# EAGLE design db_02 (EAGLE 7.7.0)
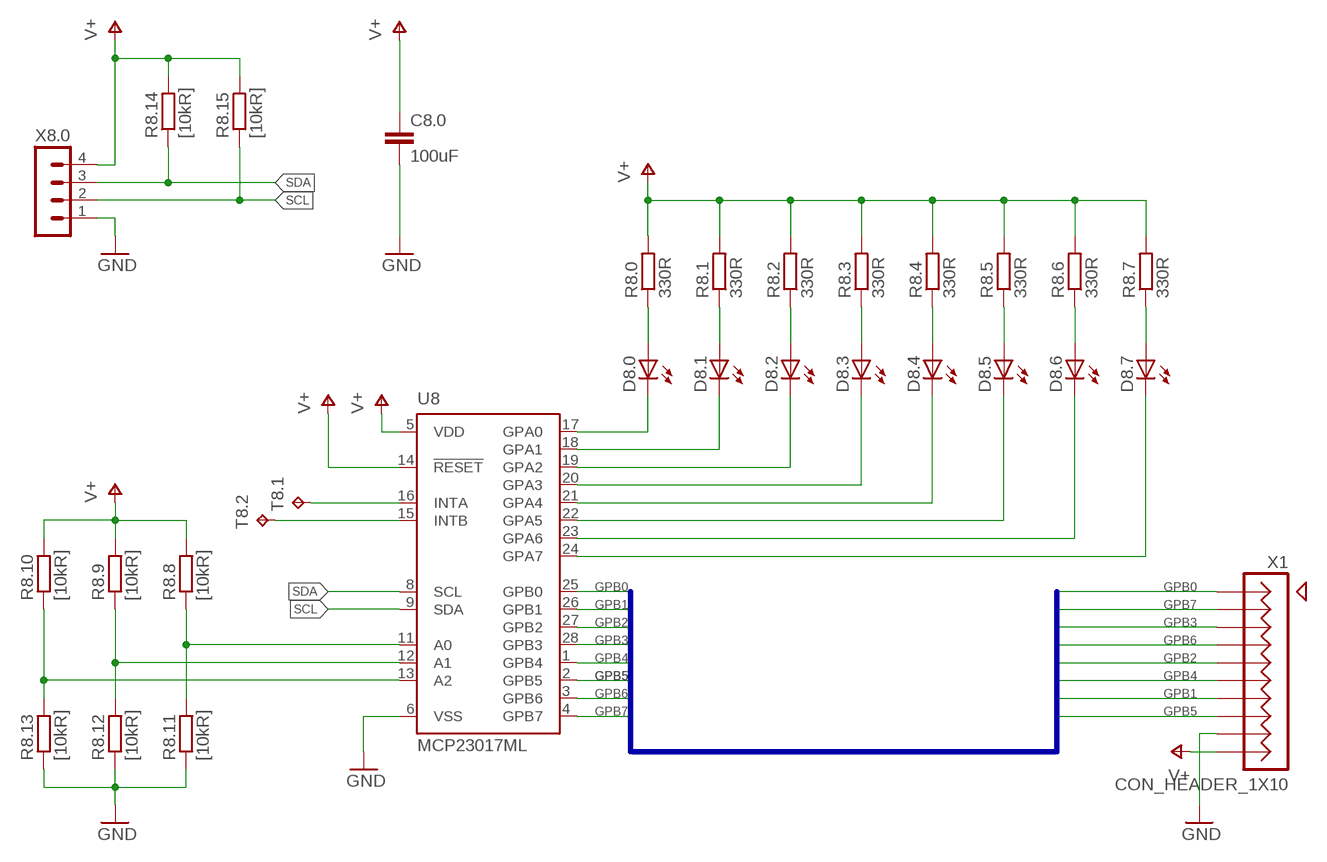
[diagram p0: schematic, sheet 1]

## Parts
C8.0  100uF  C-EUC0603  [C0603]
D8.0  LEDCHIPLED_1206  [CHIPLED_1206]
D8.1  LEDCHIPLED_1206  [CHIPLED_1206]
D8.2  LEDCHIPLED_1206  [CHIPLED_1206]
D8.3  LEDCHIPLED_1206  [CHIPLED_1206]
D8.4  LEDCHIPLED_1206  [CHIPLED_1206]
D8.5  LEDCHIPLED_1206  [CHIPLED_1206]
D8.6  LEDCHIPLED_1206  [CHIPLED_1206]
D8.7  LEDCHIPLED_1206  [CHIPLED_1206]
R8.0  330R  R-EU_R0603  [R0603]
R8.1  330R  R-EU_R0603  [R0603]
R8.2  330R  R-EU_R0603  [R0603]
R8.3  330R  R-EU_R0603  [R0603]
R8.4  330R  R-EU_R0603  [R0603]
R8.5  330R  R-EU_R0603  [R0603]
R8.6  330R  R-EU_R0603  [R0603]
R8.7  330R  R-EU_R0603  [R0603]
R8.8  [10kR]  R-EU_R0402  [R0402]
R8.9  [10kR]  R-EU_R0402  [R0402]
R8.10  [10kR]  R-EU_R0402  [R0402]
R8.11  [10kR]  R-EU_R0402  [R0402]
R8.12  [10kR]  R-EU_R0402  [R0402]
R8.13  [10kR]  R-EU_R0402  [R0402]
R8.14  [10kR]  R-EU_R0402  [R0402]
R8.15  [10kR]  R-EU_R0402  [R0402]
T8.1  TPTP09SQ  [TP09SQ]
T8.2  TPTP09SQ  [TP09SQ]
U8  MCP23017ML  [QFN28-ML_6X6MM]
X1  CON_HEADER_1X10  [M1X10_SMD]
X8.0  MA04-1  [MA04-1]

## Nets
GND: C8.0.2 R8.11.1 R8.12.1 R8.13.1 U8.6(VSS) X1.P$9 X8.0.1
GPB0: U8.25(GPB0) X1.P$1
GPB1: U8.26(GPB1) X1.P$7
GPB2: U8.27(GPB2) X1.P$5
GPB3: U8.28(GPB3) X1.P$3
GPB4: U8.1(GPB4) X1.P$6
GPB5: U8.2(GPB5) X1.P$8
GPB6: U8.3(GPB6) X1.P$4
GPB7: U8.4(GPB7) X1.P$2
N$1: D8.0.C U8.17(GPA0)
N$2: D8.1.C U8.18(GPA1)
N$3: D8.2.C U8.19(GPA2)
N$4: D8.3.C U8.20(GPA3)
N$5: D8.4.C U8.21(GPA4)
N$6: D8.5.C U8.22(GPA5)
N$7: D8.6.C U8.23(GPA6)
N$8: D8.7.C U8.24(GPA7)
N$9: D8.0.A R8.0.1
N$10: D8.1.A R8.1.1
N$11: D8.2.A R8.2.1
N$12: D8.3.A R8.3.1
N$13: D8.4.A R8.4.1
N$14: D8.5.A R8.5.1
N$15: D8.6.A R8.6.1
N$16: D8.7.A R8.7.1
N$17: R8.8.1 R8.11.2 U8.11(A0)
N$18: R8.9.1 R8.12.2 U8.12(A1)
N$19: R8.10.1 R8.13.2 U8.13(A2)
N$23: T8.1.TP U8.16(INTA)
N$24: T8.2.TP U8.15(INTB)
SCL: R8.15.1 U8.9(SDA) X8.0.2
SDA: R8.14.1 U8.8(SCL) X8.0.3
V+: C8.0.1 R8.0.2 R8.1.2 R8.2.2 R8.3.2 R8.4.2 R8.5.2 R8.6.2 R8.7.2 R8.8.2 R8.9.2 R8.10.2 R8.14.2 R8.15.2 U8.5(VDD) U8.14(!RESET) X1.P$10 X8.0.4

## Buses
GPB[0..7]

## Library data of the parts
C8.0 = rcl:C-EU: CAPACITOR, European symbol
D8.0 D8.1-D8.7 = led:LED: LED OSRAM: - CHIPLED LG R971, LG N971, LY N971, LG Q971, LY Q971, LO R971, LY R971 LH N974, LH R974 LS Q976, LO Q976, LY Q976 LO Q996 - Hyper CHIPLED LW Q18S LB Q993, LB Q99A, LB R99A - SideLED LS A670, LO A670, LY A670, LG A670, LP A670 LB A673, LV A673, LT A673, LW A673 LH A674 LY A675 LS A676, LA A676, LO A676, LY A676, LW A676 LS A679, LY A679, LG A679 - Hyper Micro SIDELED® LS Y876, LA Y876, LO Y876, LY Y876 LT Y87S - SmartLED LW L88C, LW L88S LB L89C, LB L89S, LG L890 LS L89K, LO L89K, LY L89K LS L896, LA L896, LO L896, LY L896 - TOPLED LS T670, LO T670, LY T670, LG T670, LP T670 LSG T670, LSP T670, LSY T670, LOP T670, LYG T670 LG T671, LOG T671, LSG T671 LB T673, LV T673, LT T673, LW T673 LH T674 LS T676, LA T676, LO T676, LY T676, LB T676, LH T676, LSB T676, LW T676 LB T67C, LV T67C, LT T67C, LS T67K, LO T67K, LY T67K, LW E67C LS E67B, LA E67B, LO E67B, LY E67B, LB E67C, LV E67C, LT E67C LW T67C LS T679, LY T679, LG T679 LS T770, LO T770, LY T770, LG T770, LP T770 LB T773, LV T773, LT T773, LW T773 LH T774 LS E675, LA E675, LY E675, LS T675 LS T776, LA T776, LO T776, LY T776, LB T776 LHGB T686 LT T68C, LB T68C - Hyper Mini TOPLED® LB M676 - Mini TOPLED Santana® LG M470 LS M47K, LO M47K, LY M47K Source: http://www.osram.convergy.de LUXEON: - LUMILED® LXK2-PW12-R00, LXK2-PW12-S00, LXK2-PW14-U00, LXK2-PW14-V00 LXK2-PM12-R00, LXK2-PM12-S00, LXK2-PM14-U00 LXK2-PE12-Q00, LXK2-PE12-R00, LXK2-PE12-S00, LXK2-PE14-T00, LXK2-PE14-U00 LXK2-PB12-K00, LXK2-PB12-L00, LXK2-PB12-M00, LXK2-PB14-N00, LXK2-PB14-P00, LXK2-PB14-Q00 LXK2-PR12-L00, LXK2-PR12-M00, LXK2-PR14-Q00, LXK2-PR14-R00 LXK2-PD12-Q00, LXK2-PD12-R00, LXK2-PD12-S00 LXK2-PH12-R00, LXK2-PH12-S00 LXK2-PL12-P00, LXK2-PL12-Q00, LXK2-PL12-R00 Source: www.luxeon.com KINGBRIGHT: KA-3528ASYC Source: www.kingbright.com
R8.0 R8.1-R8.15 = rcl:R-EU_: RESISTOR, European symbol
T8.1 T8.2 = testpad:TP: Test pad
U8 = microchip:MCP23017: http://ww1.microchip.com/downloads/en/DeviceDoc/21952a.pdf Source: http://ww1.microchip.com/downloads/en/DeviceDoc/21952a.pdf; MF: MICROCHIP; MPN: MCP23017-E/ML; OC_FARNELL: unknown; OC_NEWARK: 31K2957
X1 = kitt.con:CON_HEADER_1X10
X8.0 = con-lstb:MA04-1: PIN HEADER; OC_FARNELL: unknown; OC_NEWARK: unknown

## Board
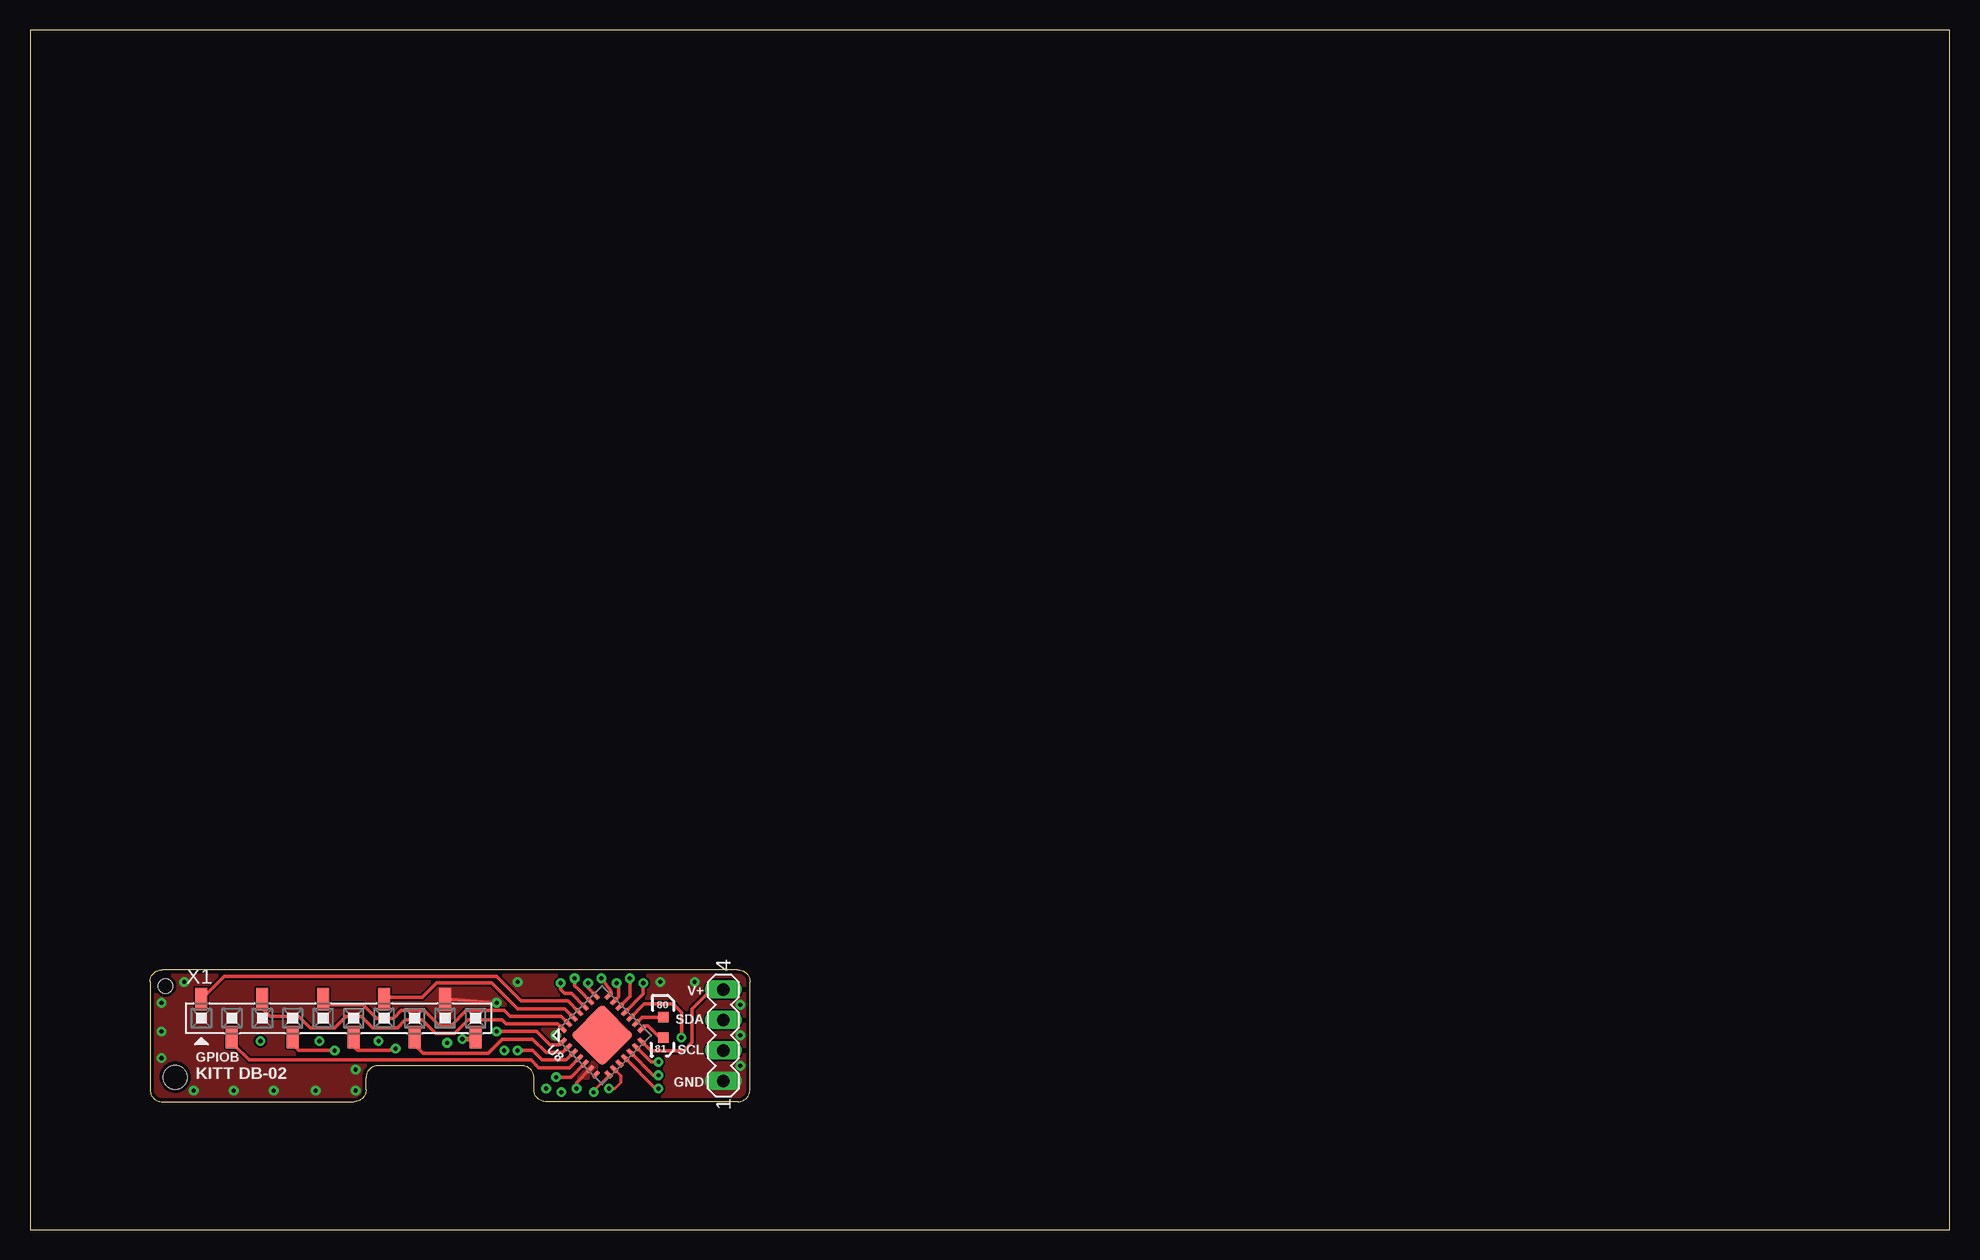
[diagram p1: board, top side]
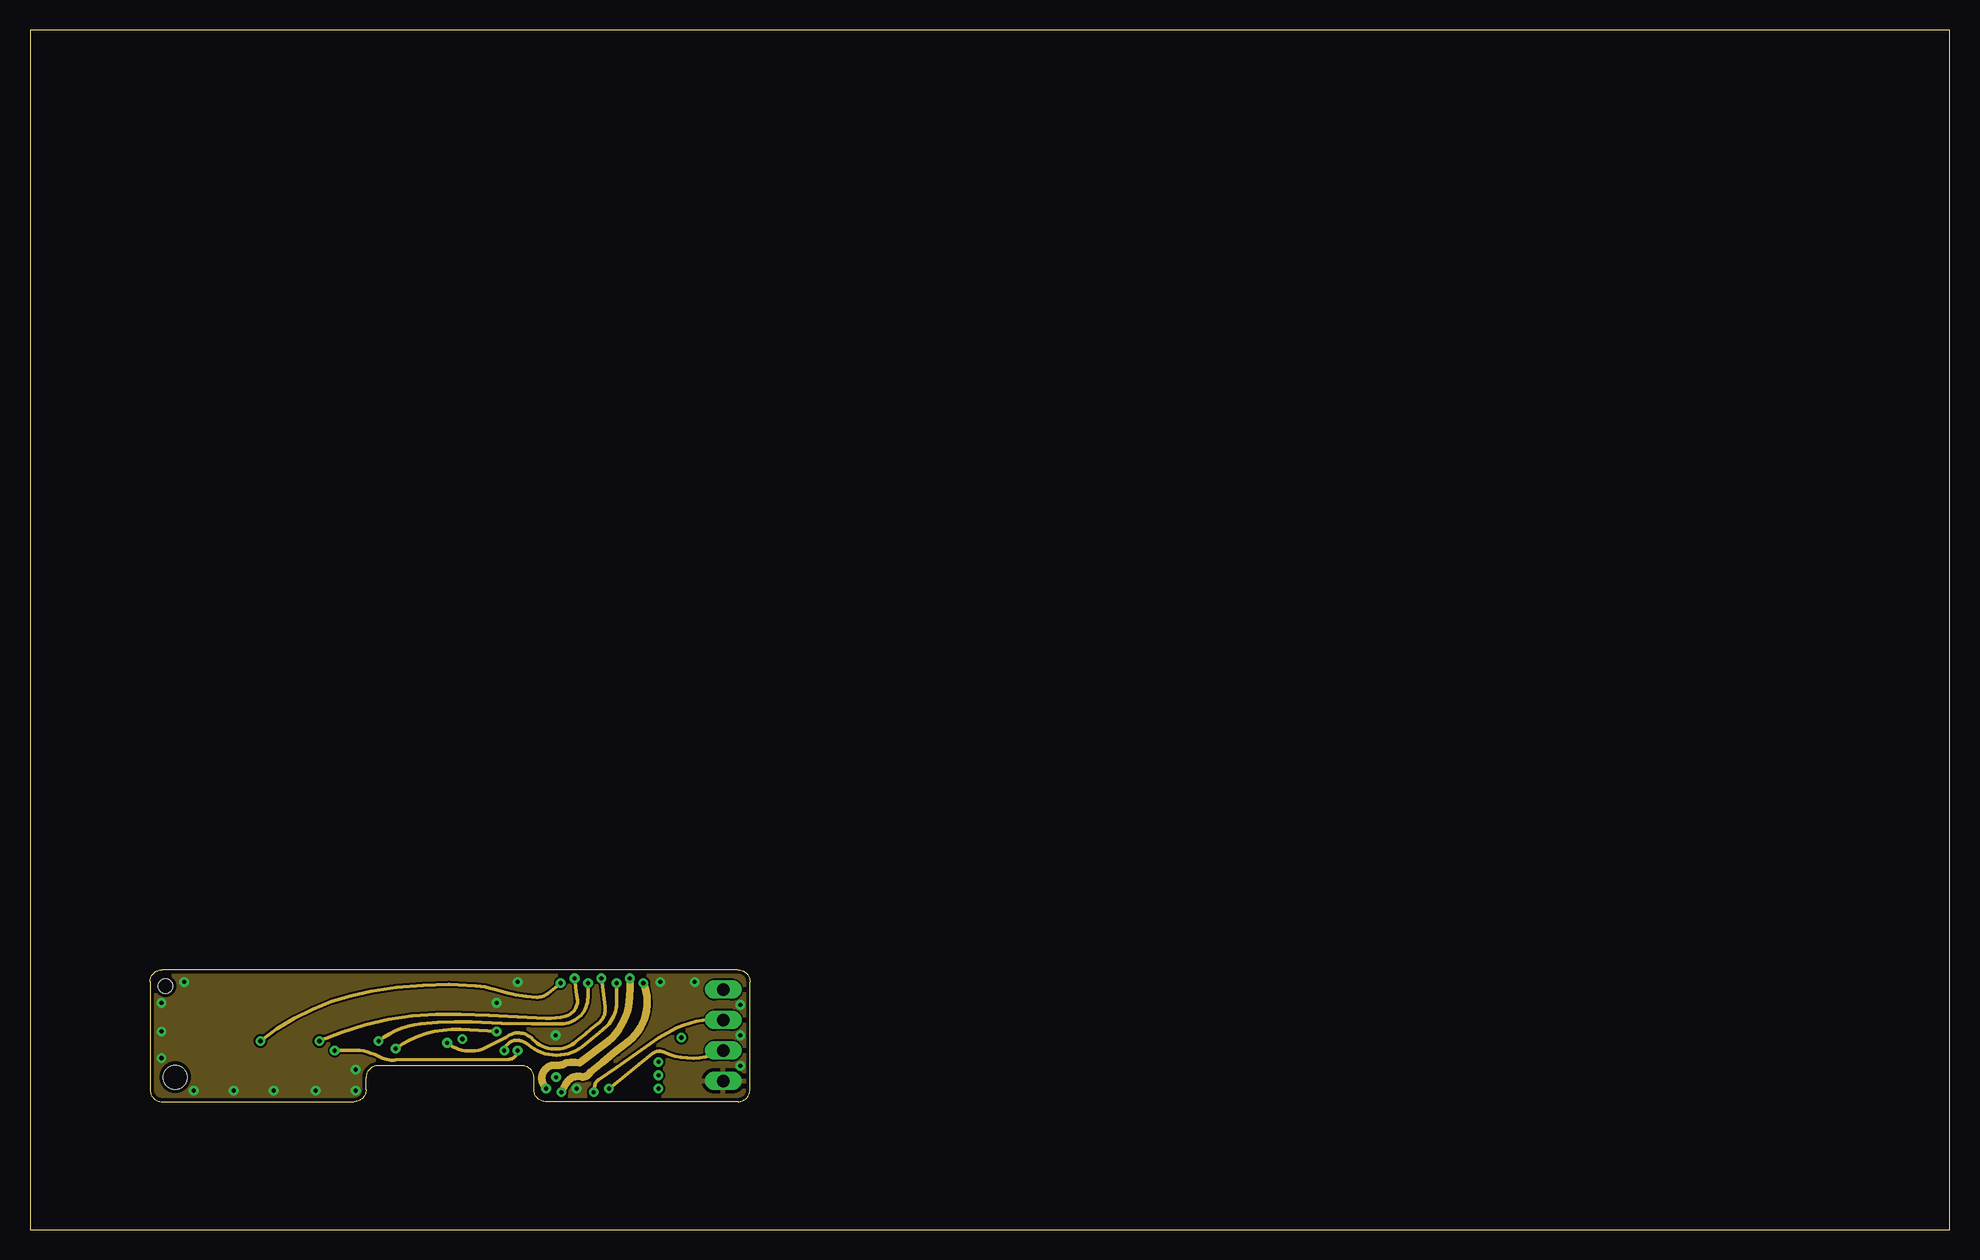
[diagram p2: board, inner layer Route2]
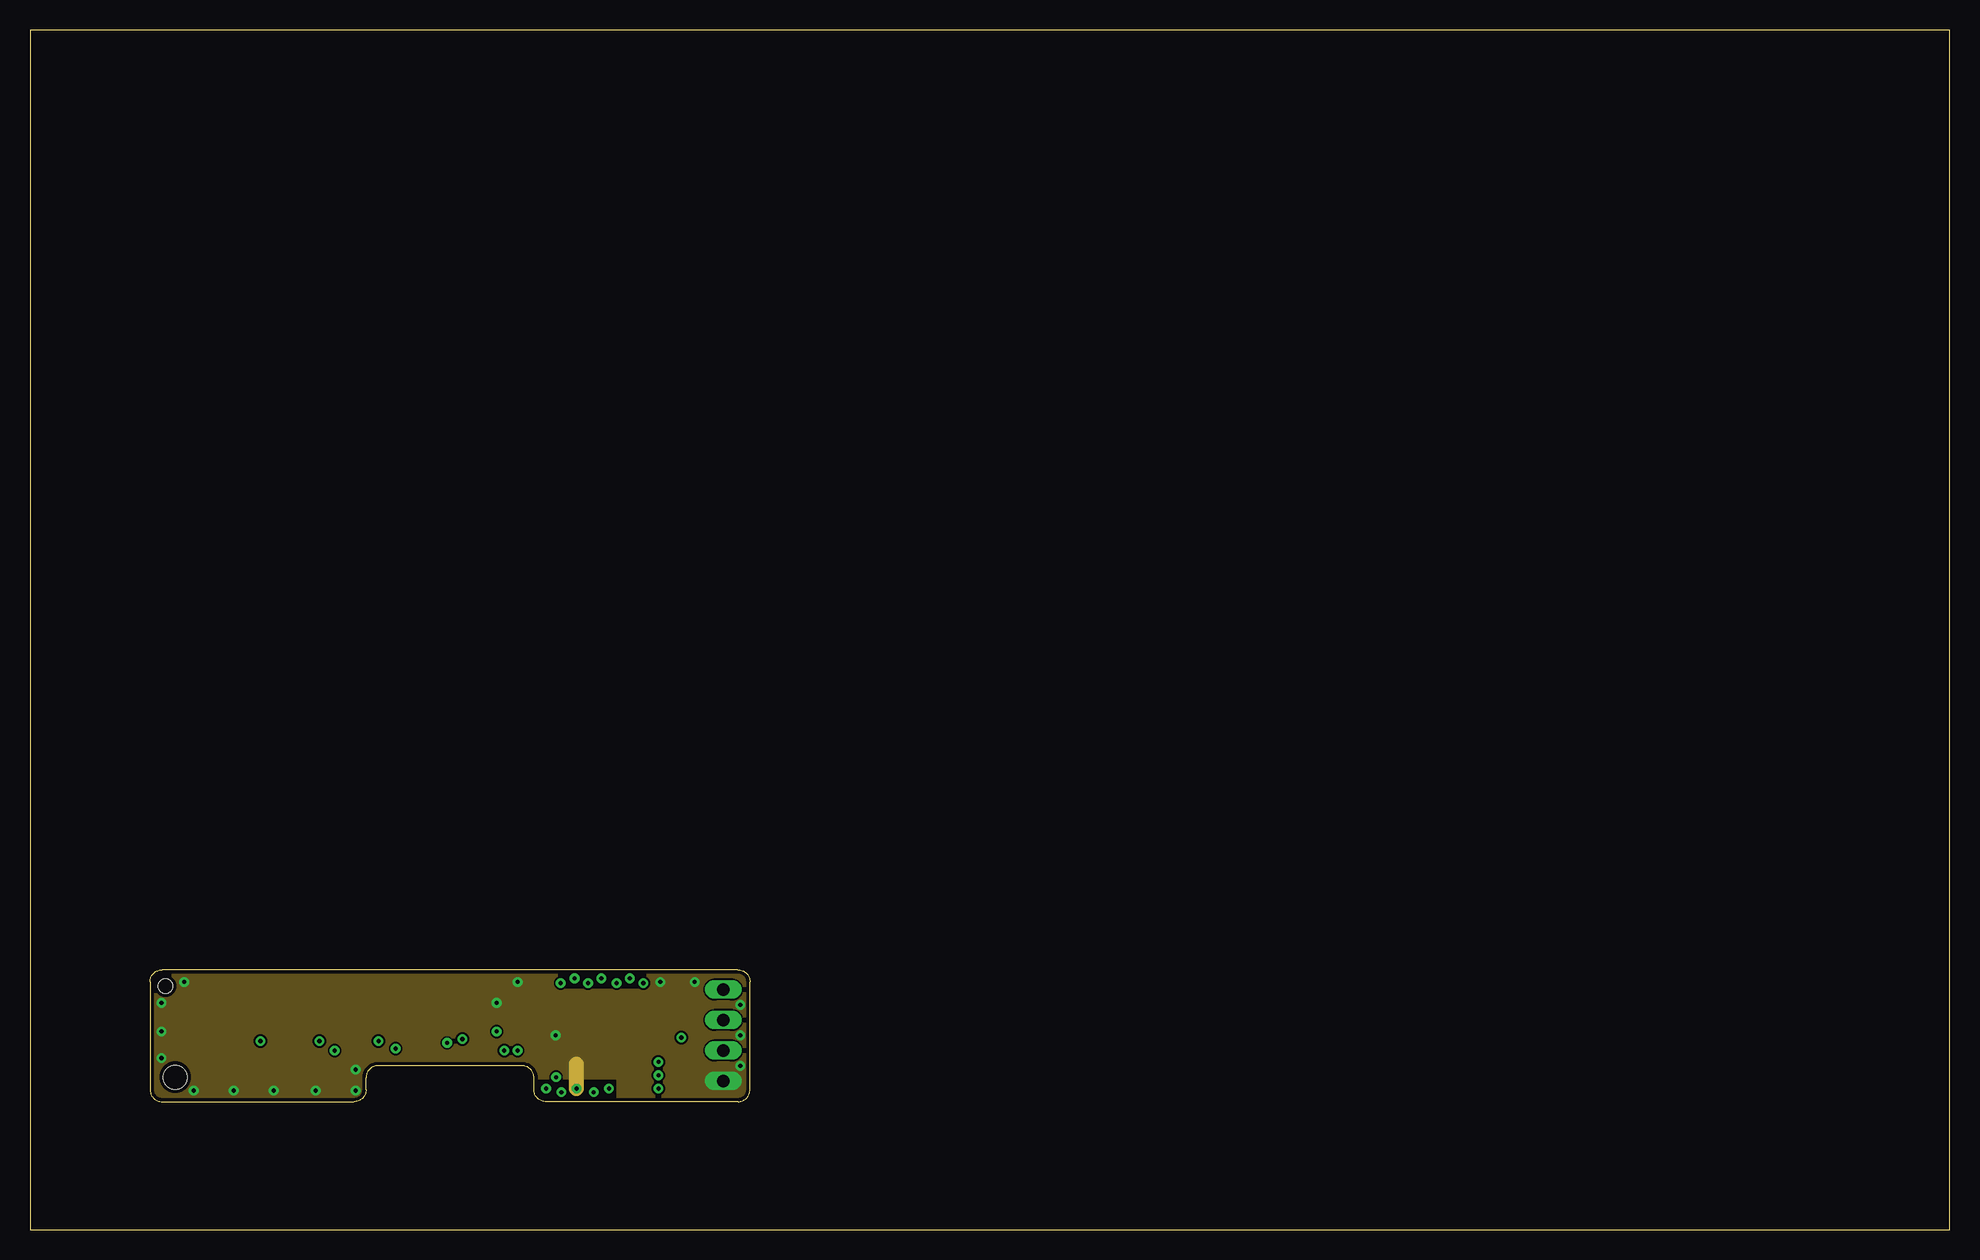
[diagram p3: board, inner layer Route3]
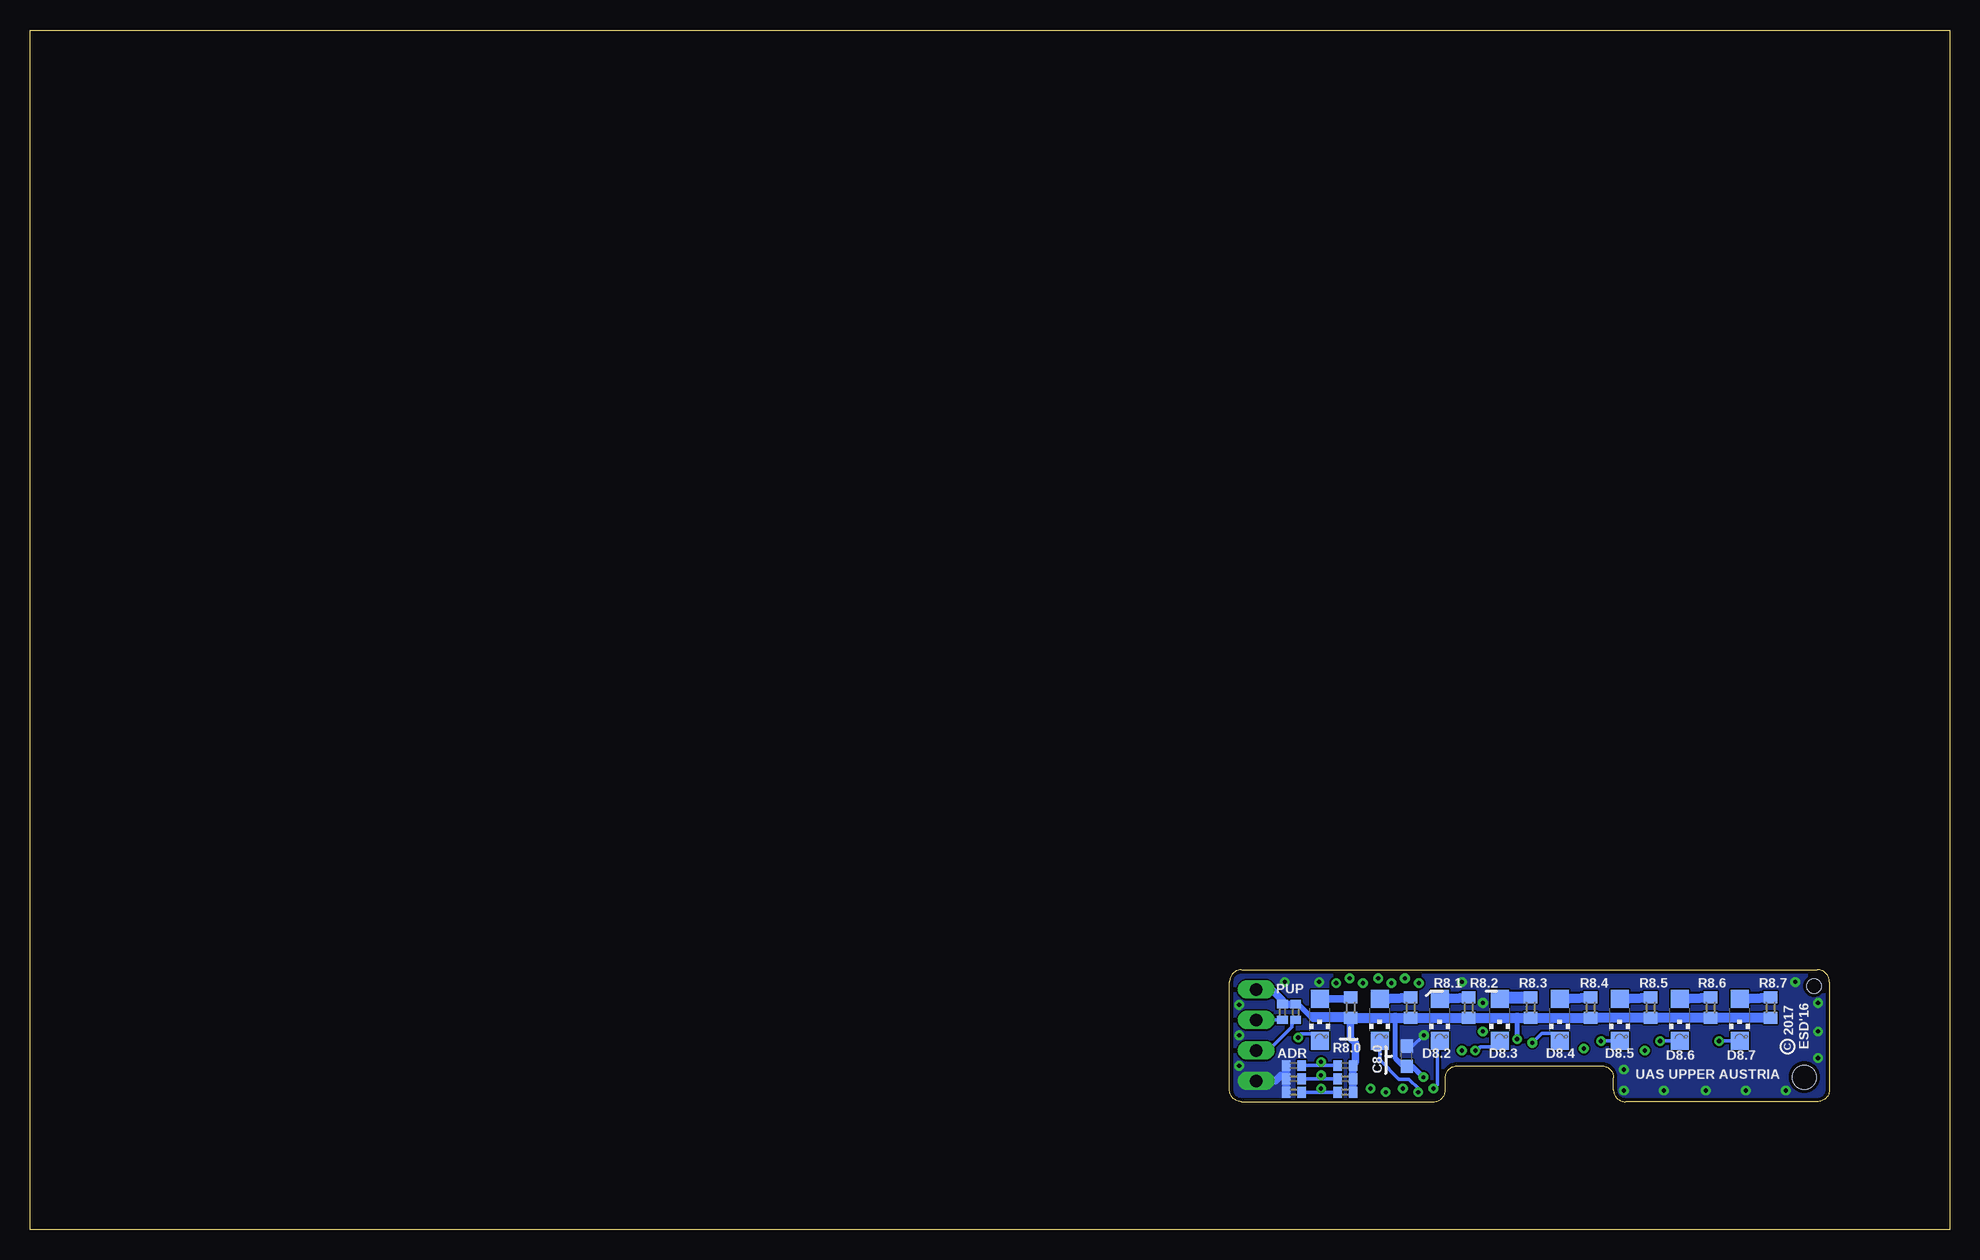
[diagram p4: board, bottom side, seen from below]

Size 160 x 100 mm. Coordinates in mm from the lower left corner, seen from the top.
Outline: 10.02,20.65 10.02,20.65
Outline: 10.02,20.65 10.02,11.65
Outline: 10.02,11.65 10.02,11.65
Outline: 58.99,21.65 11.03,21.65
Outline: 60.02,11.65 60.02,11.65
Outline: 60.02,11.65 60.02,20.65
Outline: 60.02,20.65 60.02,20.65
Outline: 28.02,12.65 28.02,11.65 arc-90 27.02,10.65
Outline: 28.02,12.65 28.02,12.66
Outline: 11.03,10.65 26.99,10.65
Outline: 10.02,20.65 arc-90 11.02,21.65
Outline: 59.02,21.65 arc-90 60.02,20.65
Outline: 60.02,11.65 arc-90 59.02,10.65 43.02,10.65 arc-90 42.02,11.65 42.02,12.65 arc90 41.02,13.65 29.02,13.65 arc90 28.02,12.65
Outline: 10.02,11.65 arc90 11.02,10.65
Outline: 0,0 160,0 160,100 0,100 0,0
Copper layers (1*2+3*4+5*6+7*16): Top 0.035mm / dielectric 0.2mm / Route2 0.035mm / dielectric 0.15mm / Route3 0.035mm / dielectric 0.2mm / layer 4 0.035mm / dielectric 0.15mm / layer 5 0.035mm / dielectric 0.2mm / layer 6 0.035mm / dielectric 0.15mm / layer 7 0.035mm / dielectric 0.2mm / Bottom 0.035mm
Design rules "Eagle_WEdirekt_150_check": minimum track width 6mil, minimum drill 0.25mm, track to track 6mil, track to pad 8mil, pad to pad 8mil, via to via 6mil, smd to smd 8mil, copper to edge 12mil, drill to drill 24mil, minimum pad ring 9mil, minimum via ring 9mil, stop-mask expansion 3mil, vias tented up to drill 0mil, thermal gap 12mil
Holes 1.2 mm at 11.3,20.3
Holes 2 mm at 12.1,12.7

### Footprints (pad centres in the part's own frame; a part is rotated, then mirrored left to right if it is on the bottom)
C0603 = smd 1.1 x 1: 1 -0.85,0; 2 0.85,0
CHIPLED_1206 = smd 1.5 x 1.5: A 0,-1.75; C 0,1.75
R0603 = smd 1 x 1.1: 1 -0.85,0; 2 0.85,0
R0402 = smd 0.7 x 0.9: 1 -0.65,0; 2 0.65,0
TP09SQ = smd 0.9 x 0.9: TP 0,0
QFN28-ML_6X6MM = smd 0.7 x 0.35: 1 -2.7,1.95; 2 -2.7,1.3; 3 -2.7,0.65; 4 -2.7,0; 5 -2.7,-0.65; 6 -2.7,-1.3; 7 -2.7,-1.95; 15 2.7,-1.95; 16 2.7,-1.3; 17 2.7,-0.65; 18 2.7,0; 19 2.7,0.65; 20 2.7,1.3; 21 2.7,1.95 | smd 0.35 x 0.7: 8 -1.95,-2.7; 9 -1.3,-2.7; 10 -0.65,-2.7; 11 0,-2.7; 12 0.65,-2.7; 13 1.3,-2.7; 14 1.95,-2.7; 22 1.95,2.7; 23 1.3,2.7; 24 0.65,2.7; 25 0,2.7; 26 -0.65,2.7; 27 -1.3,2.7; 28 -1.95,2.7 | smd 3.7 x 3.7: EXP 0,0
M1X10_SMD = smd 1 x 1.9: P$1 -11.43,1.587; P$2 -8.89,-1.587; P$3 -6.35,1.587; P$4 -3.81,-1.587; P$5 -1.27,1.587; P$6 1.27,-1.587; P$7 3.81,1.587; P$8 6.35,-1.587; P$9 8.89,1.587; P$10 11.43,-1.587
MA04-1 = drill 1.016 long: 1 -3.81,0; 2 -1.27,0; 3 1.27,0; 4 3.81,0

### Placement (x,y rotation side)
C8.0  45.24,14.45 90 bottom
D8.0  52.5,17.5 180 bottom
D8.1  47.5,17.5 180 bottom
D8.2  42.5,17.5 180 bottom
D8.3  37.5,17.5 180 bottom
D8.4  32.5,17.5 180 bottom
D8.5  27.5,17.5 180 bottom
D8.6  22.5,17.5 180 bottom
D8.7  17.5,17.5 180 bottom
R8.0  49.92,18.5 270 bottom
R8.1  44.92,18.5 270 bottom
R8.2  40.08,18.5 270 bottom
R8.3  34.92,18.5 270 bottom
R8.4  29.92,18.5 270 bottom
R8.5  24.92,18.5 270 bottom
R8.6  19.92,18.5 270 bottom
R8.7  14.92,18.5 270 bottom
R8.8  50.37,11.45 0 bottom
R8.9  50.37,12.56 0 bottom
R8.10  50.37,13.67 0 bottom
R8.11  54.65,11.45 0 bottom
R8.12  54.65,12.56 0 bottom
R8.13  54.65,13.67 0 bottom
R8.14  55.6,18.13 90 bottom
R8.15  54.49,18.13 90 bottom
T8.1  52.8,17.7 0 top
T8.2  52.8,16 0 top
U8  47.69,16.21 45 top
X1  25.72,17.62 0 top
X8.0  57.78,16.19 90 top

### Tracks (layer width: path | path; a pad name or v marks a point on that pad's centre or on a via)
GND  (via drill 0.35)
  Top 0.305: v45.56,11.75 45.56,12.24 U8.6 | X1.P$9 v38.89,18.89
  Route3 1.27: v45.56,11.75 45.56,13.81
  Bottom 0.305: R8.12.1 55.09,12.86 | C8.0.2 44.71,15.3 v43.81,16.19
  Bottom 0.61: R8.11.1 R8.12.1 | R8.13.1 R8.12.1 | R8.12.1 55.72,12.86 56.2,12.38 X8.0.1
  other vias: 13.65,11.59 27.15,11.59 10.95,14.29 10.95,16.51 10.95,18.89 16.99,11.59 20.32,11.59 23.81,11.59 12.86,20.64 27.15,13.34 59.21,18.73 59.21,16.19 59.21,13.65 40.64,20.64 52.55,20.64 55.4,20.64
  pour Route3 (no thermals): 60,20.5 60,11.6 arc-90 59.1,10.7 49.1,10.7 49.1,12.7 42.1,12.7 arc90 41.1,13.7 28.9,13.7 arc90 28,12.8 28,11.6 arc-90 27.1,10.7 11,10.7 arc-90 10,11.7 10,20.6 arc-90 11.1,21.7 43.8,21.7 43.8,19.9 51.4,19.9 51.4,21.7 58.8,21.7 arc-90
  pour Top (no thermals): 60,20.5 60,11.6 arc-90 59.1,10.7 49.1,10.7 49.1,12.7 42.1,12.7 arc90 41.1,13.7 28.9,13.7 arc90 28,12.8 28,11.6 arc-90 27.1,10.7 11,10.7 arc-90 10,11.7 10,20.6 arc-90 11.1,21.7 43.8,21.7 43.8,19.9 51.4,19.9 51.4,21.7 58.8,21.7 arc-90
  pour Bottom (no thermals): 60,20.5 60,11.6 arc-90 59.1,10.7 49.1,10.7 49.1,12.7 42.1,12.7 arc90 41.1,13.7 28.9,13.7 arc90 28,12.8 28,11.6 arc-90 27.1,10.7 11,10.7 arc-90 10,11.7 10,20.6 arc-90 11.1,21.7 43.8,21.7 43.8,19.9 51.4,19.9 51.4,21.7 58.8,21.7 arc-90
  pour Route2: 10,20.64 arc-90 10.95,21.59 58.9,21.59 arc-90 60.01,20.48 60.01,11.75 arc-90 58.9,10.64 43.02,10.64 arc-90 42.07,11.59 42.07,12.7 arc90 41.12,13.65 28.89,13.65 arc90 27.94,12.7 27.94,11.59 arc-90 26.99,10.64 11.11,10.64 arc-90 10,11.75
GPB0
  Top 0.305: U8.25 44.85,19.05 40.96,19.05 38.89,21.11 16.19,21.11 14.45,19.37
  Top 0.406: 14.45,19.37 14.29,19.37 X1.P$1
GPB1
  Top 0.305: U8.26 44.56,18.41 40.64,18.41 38.5,20.56 33.89,20.56 32.7,19.37 29.69,19.37 X1.P$7 29.53,19.53
GPB2
  Top 0.305: U8.27 44.28,17.78 40.01,17.78 39.53,18.26 36.35,18.26 35.08,16.99 34.13,16.99 32.86,18.26 30.96,18.26 30.32,17.62 28.89,17.62 27.78,18.73 24.61,18.73 | 24.61,18.41 24.61,18.73 | 24.61,18.73 24.61,19.05 X1.P$5
GPB3
  Top 0.305: U8.28 43.99,17.14 39.69,17.14 39.37,17.46 36.51,17.46 35.4,16.35 33.81,16.35 32.7,17.46 31.27,17.46 30.64,16.83 28.57,16.83 27.62,17.78 26.35,17.78 25.4,16.83 23.34,16.83 22.38,17.78 20,17.78 19.53,18.26 19.53,19.05 X1.P$3
GPB4  (via drill 0.35)
  Top 0.305: 44.28,15.56 U8.1 44.12,15.4 43.34,15.4 42.23,16.51 v38.89,16.51 | v30.48,15.08 30.16,15.08 30,14.92 27.3,14.92 27.15,15.08 27.15,15.88 X1.P$6
  Route2 0.305: v38.89,16.51 35.88,16.67 arc39 v30.48,15.08
GPB5
  Top 0.305: U8.2 44.41,14.76 43.02,14.76 41.91,15.88 39.37,15.88 38.18,14.68 32.78,14.68 32.07,15.4 X1.P$8
GPB6  (via drill 0.35)
  Top 0.305: v40.64,14.92 41.91,14.92 42.7,14.13 44.69,14.13 U8.3 | v25.4,14.92 22.38,14.92 21.75,15.56 21.75,15.88 X1.P$4
  Route2 0.305: 40.62,14.92 v40.64,14.92 arc-90 39.92,14.2 30.48,14.13 arc-38 29.05,14.45 arc21 27.46,14.92 v25.4,14.92
GPB7
  Top 0.305: 16.99,15.4 18.26,14.13 41.75,14.13 42.39,13.49 44.98,13.49 U8.4
  Top 0.406: 16.99,15.4 16.83,15.4 X1.P$2
N$1  (via drill 0.35)
  Top 0.305: U8.17 51.2,18.8 53.6,18.8 54.3,18.1 v54.3,16
  Bottom 0.254: D8.0.C 53.05,16.3
  Bottom 0.305: v54.3,16 54.05,16.3 53.05,16.3
N$2  (via drill 0.35)
  Top 0.305: U8.18 51.12,19.64 v51.12,20.54
  Route2 0.61: v44.29,11.45 44.66,12.1 arc-85 46.06,12.7 arc51 46.7,13.1 arc-1 49.9,15.7 arc75 v51.12,20.54
  Bottom 0.305: D8.1.C 47.5,14.16 45.88,12.54 45.07,12.54 44.29,11.77 v44.29,11.45
N$3  (via drill 0.35)
  Top 0.305: U8.19 50.01,19.44 v50.01,20.94
  Route2 0.61: v43.02,11.75 43,11.8 arc-133 43.7,13.7 arc47 44.7,13.9 arc-10 45.8,13.9 48.2,15.7 arc37 49.9,18.6 arc11 v50.01,20.94
  Bottom 0.305: 42.7,15.55 D8.2.C arc-90 42.7,15.55 | 42.7,15.55 43.02,15.23 | v43.02,11.75 42.7,12.06 42.7,15.55
N$4  (via drill 0.35)
  Top 0.305: U8.20 49.05,19.41 49.05,20.48 v48.9,20.54
  Route2 0.305: v48.9,20.54 48.9,18.89 arc-45 48.1,16.99 arc-7 46.04,15.24 arc-73 41.75,15.24 arc20 40.96,15.72 arc97 v39.53,14.92
  Bottom 0.305: 37.85,15.72 arc-90 D8.3.C 37.5,15.52 37.78,15.24 39.05,15.24 v39.53,14.92
N$5  (via drill 0.35)
  Top 0.305: U8.21 48.42,19.68 48.42,19.84 v47.62,20.94
  Route2 0.305: v47.62,20.94 47.94,18.57 arc-63 47.31,17.14 arc-3 45.72,15.88 arc-95 41.91,15.88 arc59 40.32,16.35 arc16 39.69,16.03 38.42,15.4 arc-73 v34.77,15.56
  Bottom 0.305: 32.7,15.24 32.5,15.44 D8.4.C 32.58,15.75 33.18,16.35 33.97,16.35 v34.77,15.56
N$6  (via drill 0.35)
  Top 0.305: U8.22 46.51,20.14 v46.51,20.54
  Route2 0.305: v46.51,20.54 arc90 46.5,20.52 46.5,19.35 arc-90 44.29,17.14 arc-3 36.83,17.3 arc10 32.54,17.14 arc31 v29.05,15.72
  Bottom 0.305: v29.05,15.72 D8.5.C
N$7  (via drill 0.35)
  Top 0.305: U8.23 45.89,19.84 45.72,20 45.4,20.32 v45.4,20.94
  Route2 0.305: v45.4,20.94 45.56,19.53 arc-97 44.61,17.78 arc-17 43.02,17.62 arc1 35.88,17.94 arc26 v24.13,15.72
  Bottom 0.305: v24.13,15.72 D8.6.C
N$8  (via drill 0.35)
  Top 0.305: U8.24 45.13,19.68 44.55,19.68 44.23,20 v44.23,20.54
  Route2 0.305: v19.21,15.72 arc-29 28.42,19.84 arc-15 37.15,20.32 arc-14 38.73,20 arc16 42.23,19.37 arc41 43.18,19.68 v44.23,20.54
  Bottom 0.305: v19.21,15.72 D8.7.C
N$9
  Bottom 0.61: R8.0.1 50.02,19.25 D8.0.A
N$10
  Bottom 0.813: D8.1.A R8.1.1
N$11
  Bottom 0.813: D8.2.A R8.2.1
N$12
  Bottom 1.016: D8.3.A 37.4,19.35 R8.3.1
N$13
  Bottom 0.813: D8.4.A R8.4.1
N$14
  Bottom 0.813: D8.5.A R8.5.1
N$15
  Bottom 0.813: D8.6.A R8.6.1
N$16
  Bottom 0.813: D8.7.A R8.7.1
N$17  (via drill 0.35)
  Top 0.305: U8.11 52.15,11.75 v52.39,11.75
  Bottom 0.305: R8.8.1 52.39,11.45 | R8.11.2 52.39,11.45 | 52.39,11.45 v52.39,11.75
N$18  (via drill 0.35)
  Top 0.305: U8.12 51.96,12.86 v52.39,12.86
  Bottom 0.305: R8.9.1 52.39,12.56 | R8.12.2 52.39,12.56 | 52.39,12.56 v52.39,12.86
N$19  (via drill 0.35)
  Top 0.305: U8.13 51.77,13.97 v52.39,13.97
  Bottom 0.305: R8.10.1 52.39,13.67 | R8.13.2 52.39,13.67 | 52.39,13.67 v52.39,13.97
N$23
  Top 0.305: U8.16 50.52,17.22 51,17.7 T8.1.TP
N$24
  Top 0.305: U8.15 51.24,17 51.5,17 52.5,16 T8.2.TP
SCL  (via drill 0.35)
  Top 0.254: U8.9 49.21,12.85 49.21,12.22 48.74,11.75 v48.26,11.75
  Route2 0.305: v48.26,11.75 51.9,14.7 arc-60 52.8,14.8 arc52 X8.0.2
  Bottom 0.305: 57.76,14.9 X8.0.2 56.78,14.92 54.8,16.9 54.8,17.1 54.59,17.31 54.49,17.31 R8.15.1
SDA  (via drill 0.35)
  Top 0.254: U8.8 48.26,12.88 48.26,12.86 47.15,11.75 v46.99,11.45
  Route2 0.305: v46.99,11.45 47.1,12.1 arc-39 47.4,12.5 arc3 51.7,15.5 arc-11 53.9,16.8 arc-31 X8.0.3
  Bottom 0.305: R8.14.1 57.77,17.48 X8.0.3
V+  (via drill 0.35)
  Top 0.305: X8.0.4 56.8,20 55.2,18.4 55.2,15.6 54.5,14.9 51.76,14.9 U8.14 | U8.5 45.1,12.7 v43.86,12.7
  Top 0.406: X1.P$10 36.99,15.88 v36.04,15.88
  Bottom 0.305: v43.86,12.7 43.86,12.6 | 45.51,13.6 44.75,13.6
  Bottom 0.406: 53.2,17.8 53.3,17.8 54.28,18.78 R8.15.2 | 44.75,13.6 v43.86,12.7 | 46.2,17.65 46.2,14.29 45.51,13.6 C8.0.1 | v36.04,15.88 36.04,17.65
  Bottom 0.61: X8.0.4 56.52,20 55.6,19.09 R8.14.2 R8.15.2 | R8.8.2 R8.9.2 R8.10.2 49.53,13.98 49.53,15.56 49.92,15.95 R8.0.2 | 53,17.7 53.1,17.7 53.2,17.8
  Bottom 0.813: R8.7.2 R8.6.2 R8.5.2 R8.4.2 R8.3.2 36.04,17.65 R8.2.2 R8.1.2 46.2,17.65 R8.0.2 49.92,17.7 53,17.7

### Text on the board
tNames: V+ | 80 | SDA | 81 | SCL | GPIOB | KITT DB-02 | GND
bNames: PUP | ESD'16 | 2017 | C | ADR | UAS UPPER AUSTRIA